# EAGLE board stm32 v0.7 eagle_v7 (EAGLE 7.7.0), part 1 of 2
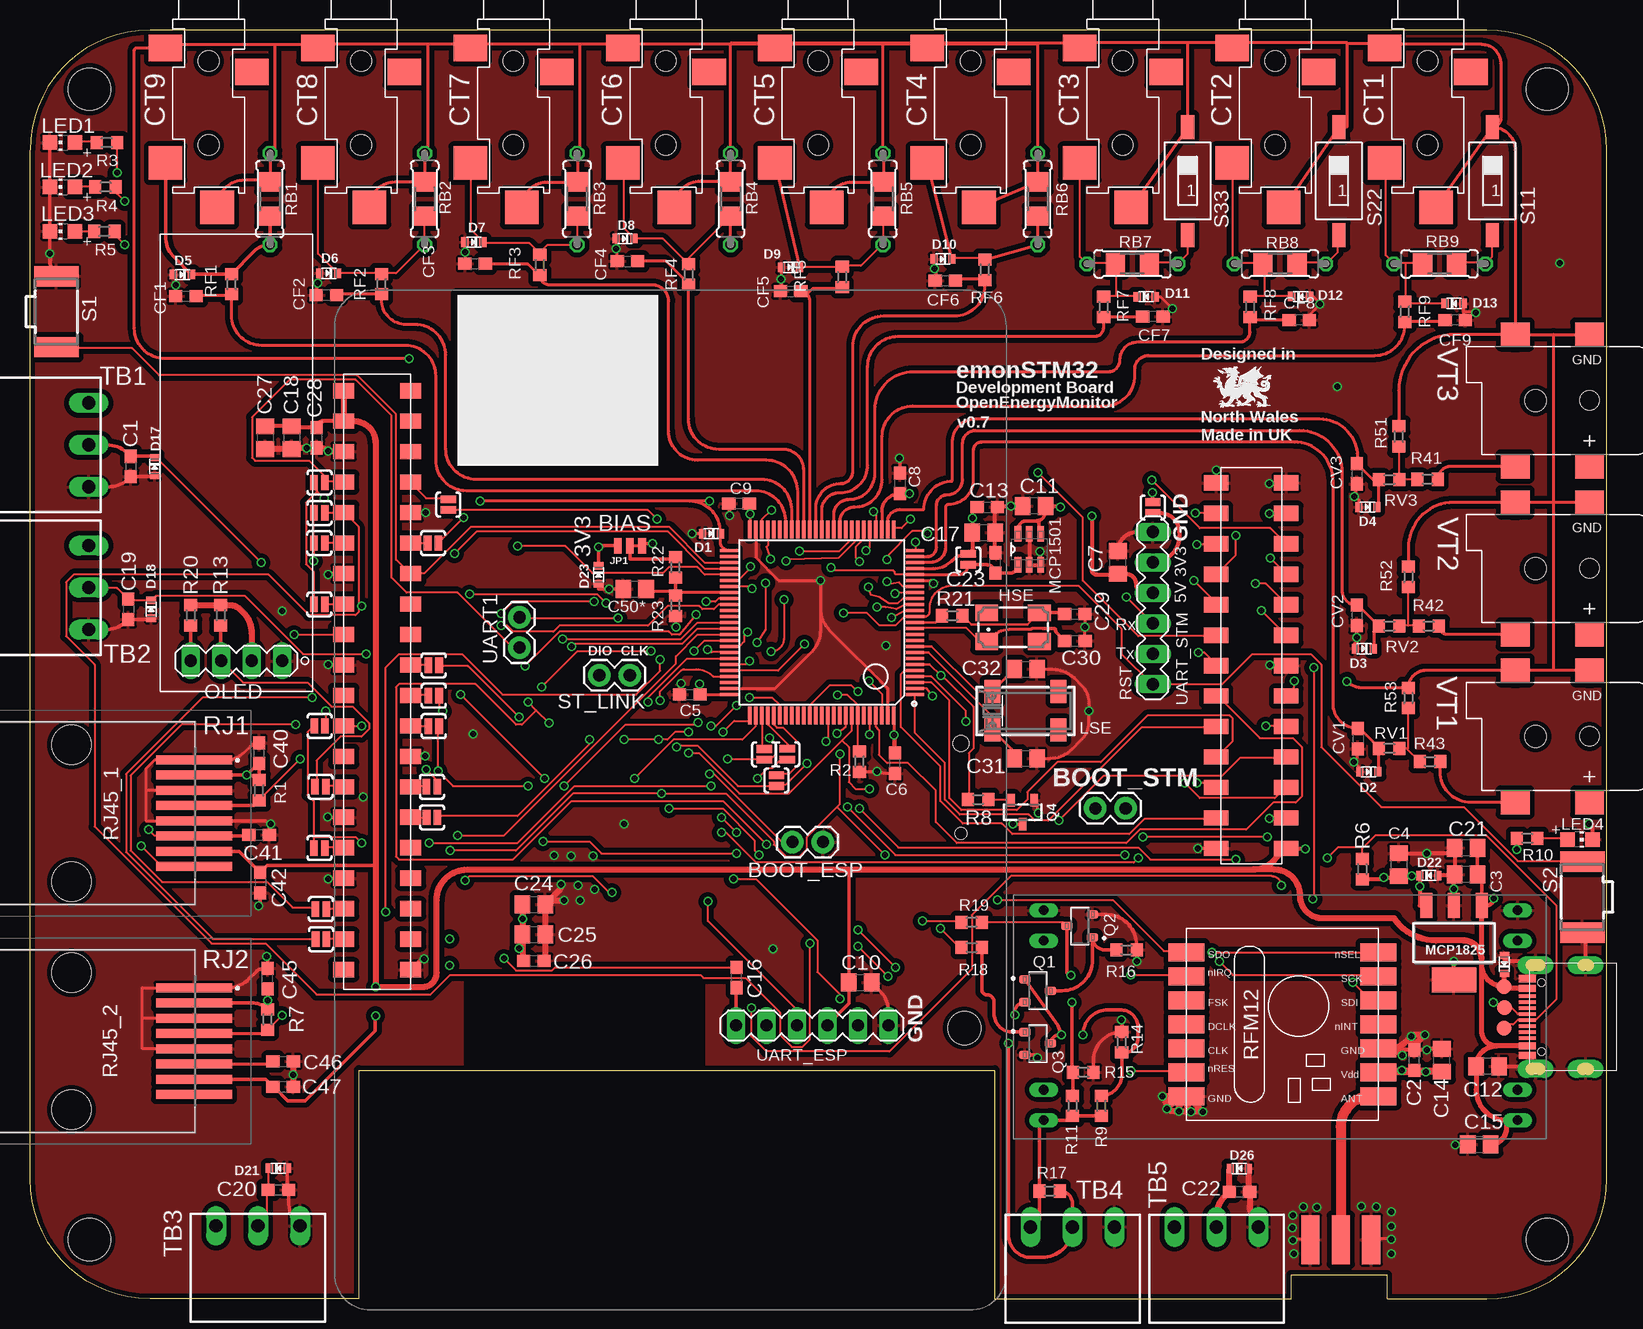
[diagram p2: board, top side]
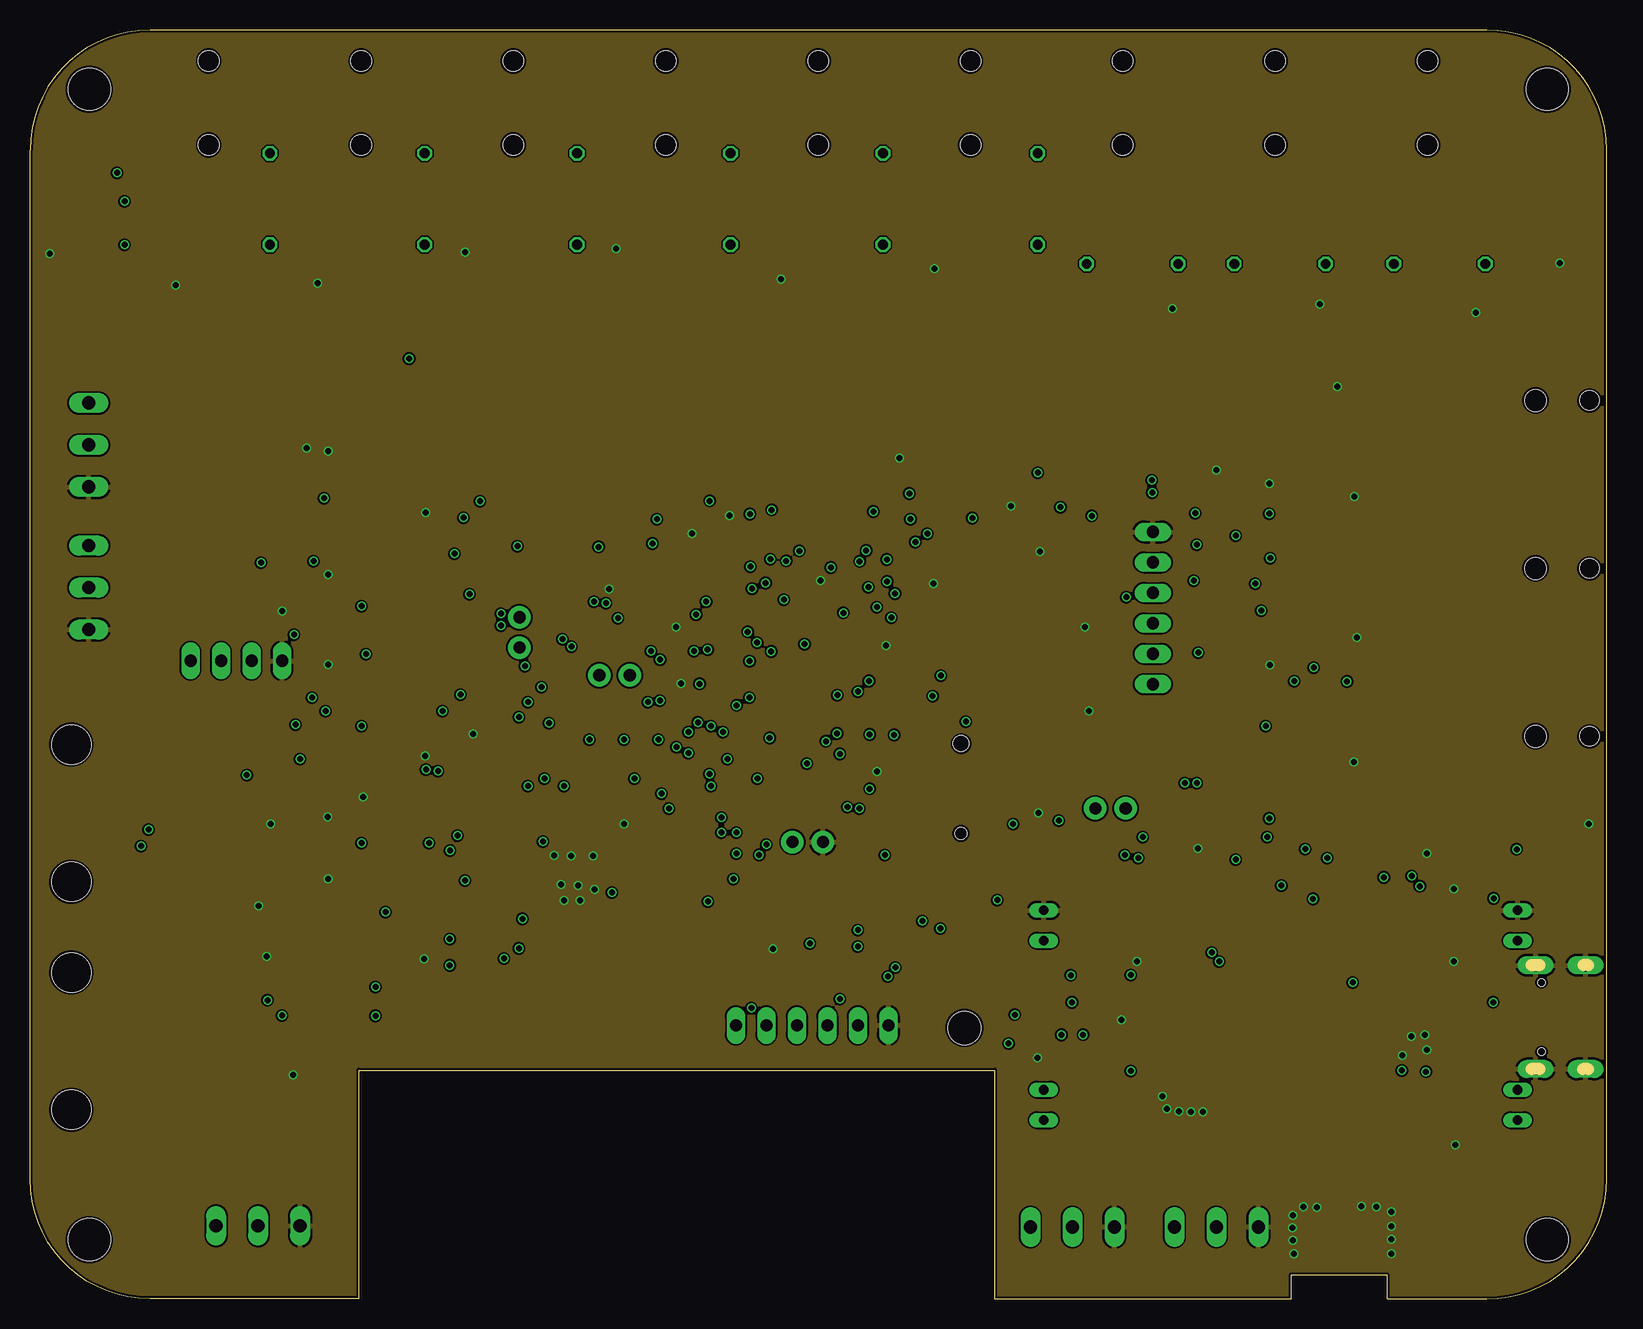
[diagram p3: board, inner layer GND]
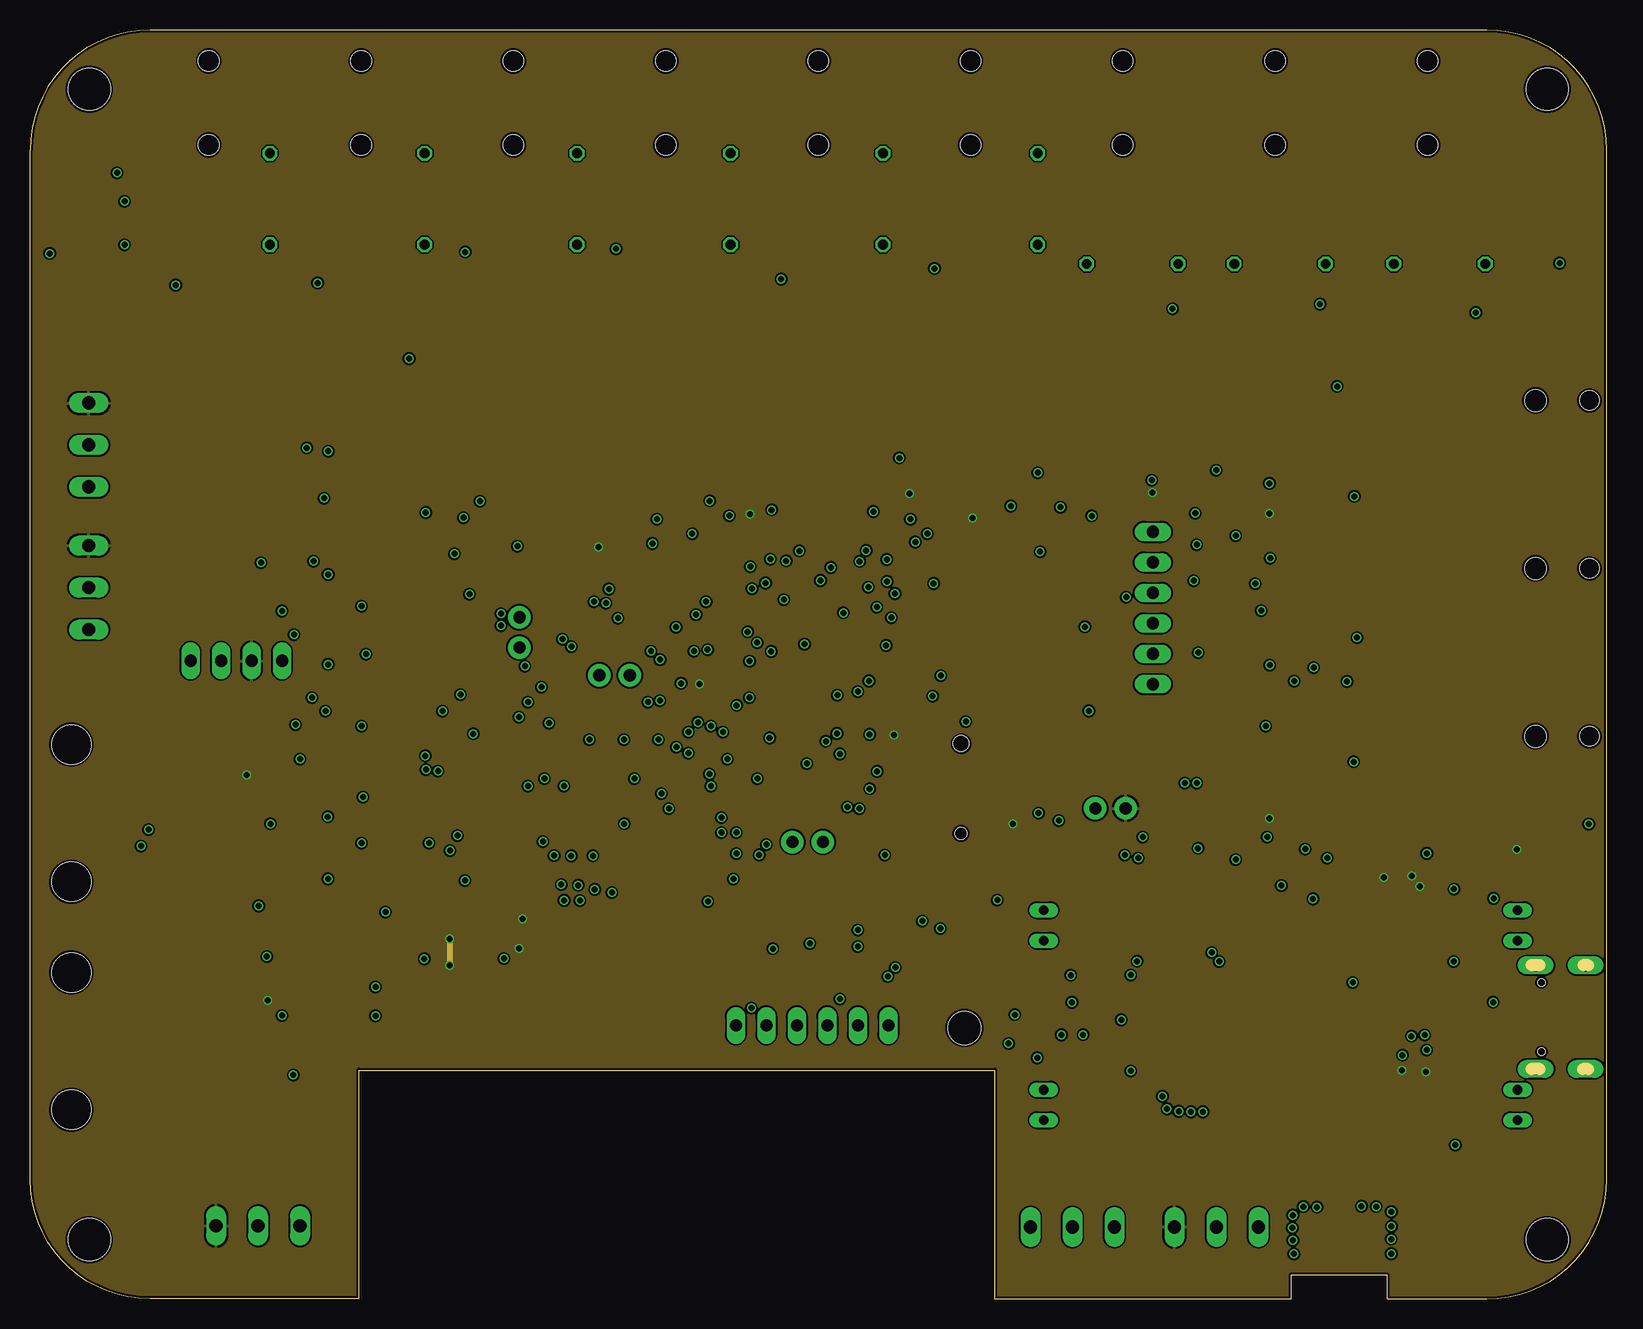
[diagram p4: board, inner layer +3V3]
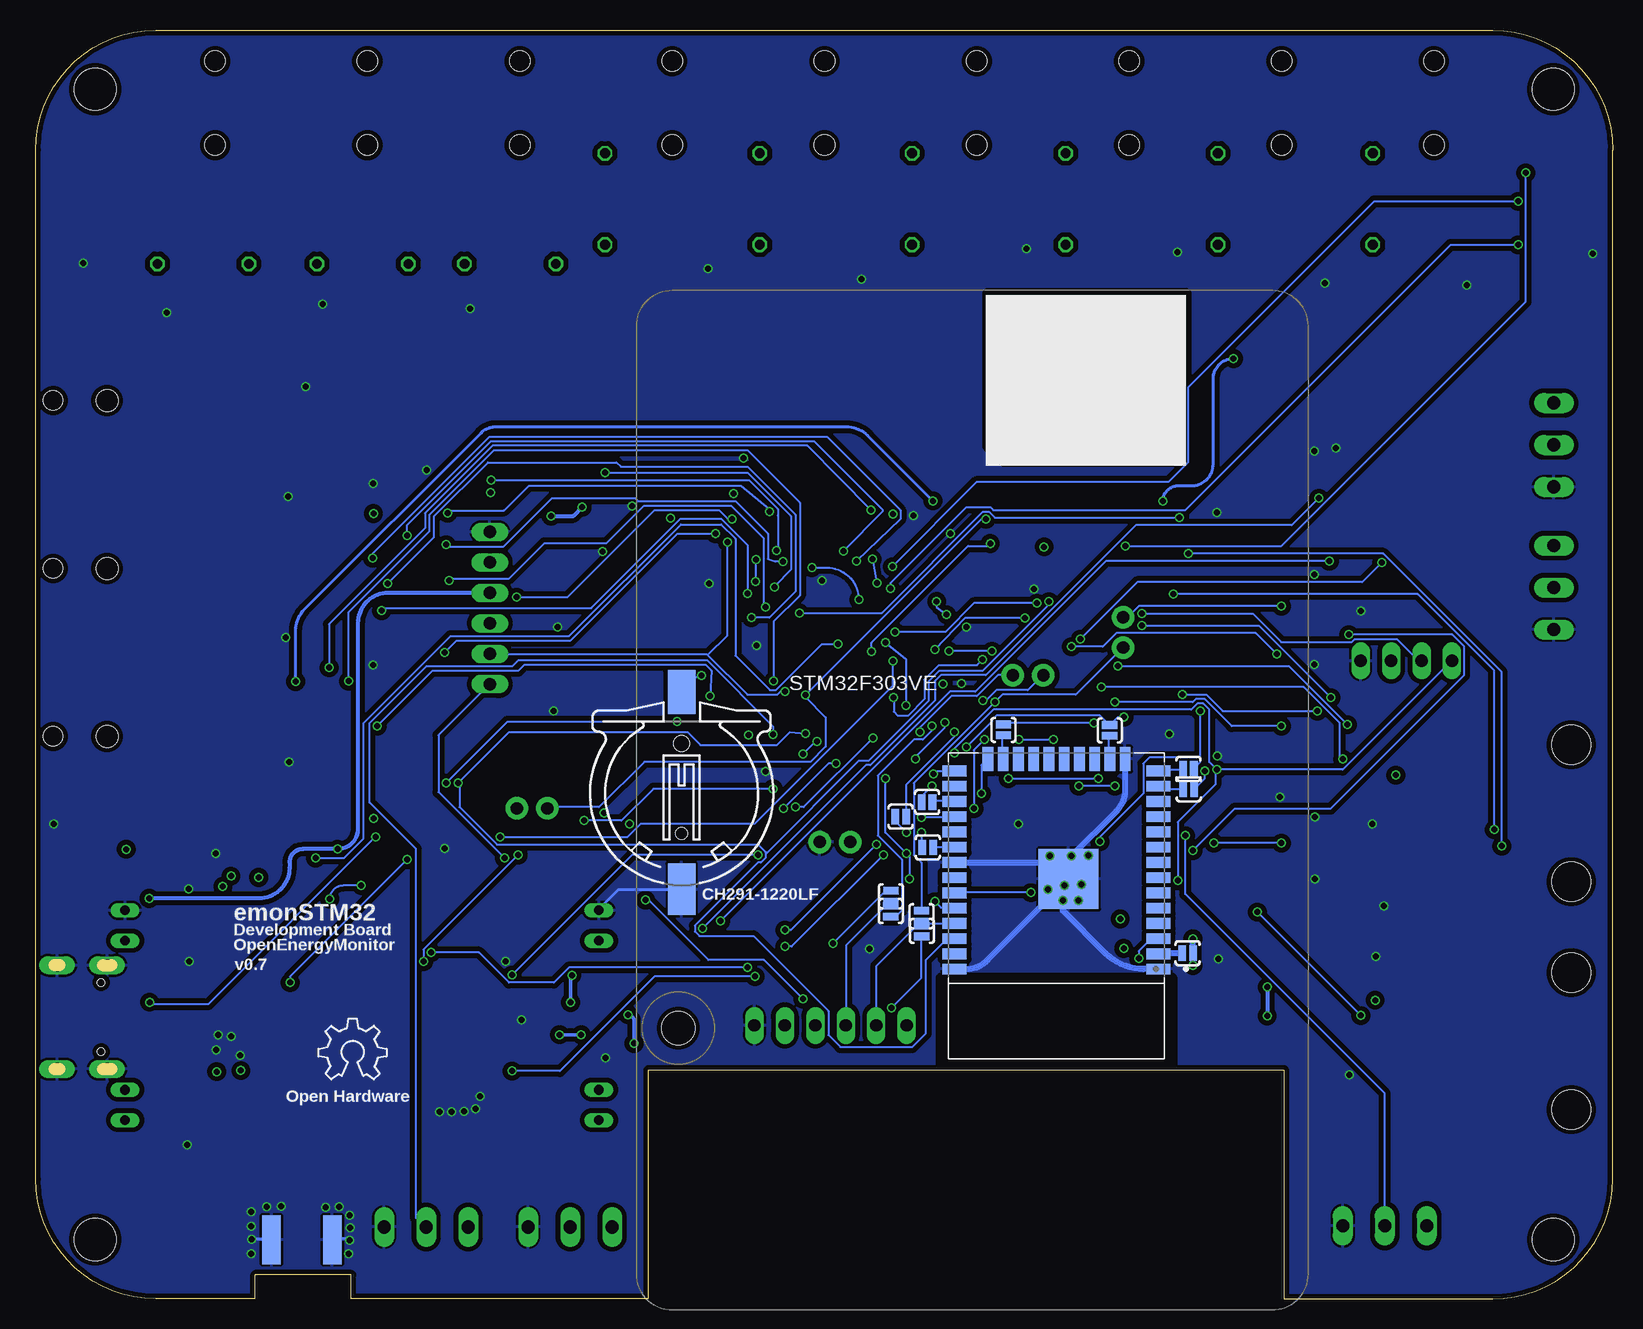
[diagram p5: board, bottom side, seen from below]

Size 131.44 x 105.79 mm. Coordinates in mm from the lower left corner, seen from the top.
Outline: 131.44,10 131.44,95.79 arc90 121.44,105.79 10,105.79 arc90 0,95.79 0,10 arc90 10,0 27.4,0 27.4,19.07 80.41,19.07 80.41,0 105.14,0 105.14,2 113.14,2 113.14,0 121.44,0 arc90 131.44,10
Copper layers (1+2*15+16): Top 0.035mm / dielectric 0.2mm / GND 0.035mm / dielectric 1.1mm / +3V3 0.035mm / dielectric 0.2mm / Bottom 0.035mm
Design rules "ragworm *": minimum track width 7mil, minimum drill 0.5mm, track to track 6mil, track to pad 6mil, pad to pad 7mil, via to via 8mil, smd to smd 0mil, copper to edge 8mil, drill to drill 10mil, minimum pad ring 3mil, minimum via ring 3mil, stop-mask expansion 2mil, vias tented up to drill 25mil, thermal gap 8mil
Net classes: 0 default: width 0.178 mm, drill 0.5 mm, clearance 0.152 mm; 1 power: width 0.305 mm, drill 0.5 mm, clearance 0.152 mm; 2 gnd: width 0.254 mm, drill 0.5 mm, clearance 0.152 mm; 3 ant: width 0.406 mm, drill 0.5 mm, clearance 0.254 mm; 4 cts_vts: width 0.254 mm, drill 0.5 mm, clearance 0.254 mm
Holes 3.5 mm at 126.49,100.85 4.95,100.85 4.95,4.95 126.49,4.95
tRestrict: area 36.6,18.4 to 55.9,26.8; area 35.6,69.8 to 52.1,83.8
bRestrict: area 36.7,18.4 to 56,26.8; area 35.6,69.8 to 52.1,83.8

## Footprints (pad centres in the part's own frame; a part is rotated, then mirrored left to right if it is on the bottom)
1X02 = drill 1.016 pad 1.88: 1 0,0; 2 2.54,0
C0603 = smd 1.1 x 1: 1 -0.85,0; 2 0.85,0
C0805 = smd 1.3 x 1.5: 1 -0.95,0; 2 0.95,0
STEREO_SMT = smd 2.8 x 2.2: P$1 -3.6,-2.4; P$3 3.6,-4.4 | smd 2.8 x 2.8: P$2 -3.6,-12; P$4 0.7,-15.7 | hole 1.7: 0,-3.5; 0,-10.5
SOD-523 = smd 0.8 x 0.6: A 0,-0.75; K 0,0.75
2X13_SMT = smd 1.27 x 2.032: 1 -15.24,-2.921; 2 -15.24,2.921; 3 -12.7,-2.921; 4 -12.7,2.921; 5 -10.16,-2.921; 6 -10.16,2.921; 7 -7.62,-2.921; 8 -7.62,2.921; 9 -5.08,-2.921; 10 -5.08,2.921; 11 -2.54,-2.921; 12 -2.54,2.921; 13 0,-2.921; 14 0,2.921; 15 2.54,-2.921; 16 2.54,2.921; 17 5.08,-2.921; 18 5.08,2.921; 19 7.62,-2.921; 20 7.62,2.921; 21 10.16,-2.921; 22 10.16,2.921; 23 12.7,-2.921; 24 12.7,2.921; 25 15.24,-2.921; 26 15.24,2.921
CH291-1220LF = smd 2.3 x 3.66: + 0,-2.296 | smd 2.3 x 4.3: - 0,14.146 | hole 1.3: 0,2 | hole 1: 0,9.5
CTS406 = smd 1.9 x 1.4: 1 -2.2,-1.2; 2 2.2,-1.2; 3 2.2,1.2; 4 -2.2,1.2
SJ_2S-NO = smd 0.635 x 1.27: 1 -0.45,0; 2 0.45,0
SMA-EDGE = smd 1.524 x 4.064: GND@0 0,0; GND@1 5.08,0; SIG 2.54,0 | smd 1.524 x 4.064 bottom: GND@2 0,0; GND@3 5.08,0
SMT-JUMPER_3_1-NC_TRACE_NO-SILK = smd 0.635 x 1.27: 1 -1.016,0; 2 0,0; 3 1.016,0
CHIP-LED0805 = smd 1.2 x 1.2: A 0,-1.05; C 0,1.05
CRYSTAL_8X3.8 = smd 1.3 x 1.9: P$1 -2.75,-1.6; P$2 2.75,-1.6; P$3 2.75,1.6; P$4 -2.75,1.6
SOT-223 = smd 1 x 2.1: 1 -2.3,-3.1; 2 0,-3.1; 3 2.3,-3.1 | smd 3.7 x 2.1: 4 0,3.1
MA04-1-OLED = drill 1.016 long: 1 -3.81,0; 2 -1.27,0; 3 1.27,0; 4 3.81,0
RPI3MIRROR2 = smd 1.27 x 1.778: P$41 8.371,6.351; P$42 8.371,0.763; P$43 10.911,6.351; P$44 10.911,0.763; P$45 13.451,6.351; P$46 13.451,0.763; P$47 15.991,6.351; P$48 15.991,0.763; P$49 18.531,6.351; P$50 18.531,0.763; P$51 21.071,6.351; P$52 21.071,0.763; P$53 23.611,6.351; P$54 23.611,0.763; P$55 26.151,6.351; P$56 26.151,0.763; P$57 28.691,6.351; P$58 28.691,0.763; P$59 31.231,6.351; P$60 31.231,0.763; P$61 33.771,6.351; P$62 33.771,0.763; P$63 36.311,6.351; P$64 36.311,0.763; P$65 38.851,6.351; P$66 38.851,0.763; P$67 41.391,6.351; P$68 41.391,0.763; P$69 43.931,6.351; P$70 43.931,0.763; P$71 46.471,6.351; P$72 46.471,0.763; P$73 49.011,6.351; P$74 49.011,0.763; P$75 51.551,6.351; P$76 51.551,0.763; P$77 54.091,6.351; P$78 54.091,0.763; P$79 56.631,6.351; P$80 56.631,0.763 | hole 2.75: 61.5,52.505
SOT23 = smd 0.71 x 0.96: 1 -0.95,-1.075; 2 0.95,-1.075; 3 0,1.075
SOT23-R = smd 0.635 x 1.016: 1 -0.95,-1; 2 0.95,-1; 3 0,1
R0603 = smd 1 x 1.1: 1 -0.85,0; 2 0.85,0
R1206 = smd 1.6 x 1.803: 1 -1.422,0; 2 1.422,0
0207/7 = drill 0.813 octagon: 1 -3.81,0; 2 3.81,0
RFM12 = smd 1.5 x 3: 1 -5,-10; 2 -3,-10; 3 -1,-10; 4 1,-10; 5 3,-10; 6 5,-10; 7 7,-10; 8 7,6; 9 5,6; 10 3,6; 11 1,6; 12 -1,6; 13 -3,6; 14 -5,6
955016889 = smd 0.76 x 6.35: 1 -4.445,8.975; 2 -3.175,8.975; 3 -1.905,8.975; 4 -0.635,8.975; 5 0.635,8.975; 6 1.905,8.975; 7 3.175,8.975; 8 4.445,8.975 | hole 3.25: -5.715,-1.25; 5.715,-1.25
KSS = smd 1.7 x 3.7: 1 -2.95,0; 2 2.95,0
SMS-001 = smd 1.092 x 2.007: 1 0,-4.496; 2 0,4.496
TQFP100 = smd 0.27 x 1.5: 1 -6,-7.75; 2 -5.5,-7.75; 3 -5,-7.75; 4 -4.5,-7.75; 5 -4,-7.75; 6 -3.5,-7.75; 7 -3,-7.75; 8 -2.5,-7.75; 9 -2,-7.75; 10 -1.5,-7.75; 11 -1,-7.75; 12 -0.5,-7.75; 13 0,-7.75; 14 0.5,-7.75; 15 1,-7.75; 16 1.5,-7.75; 17 2,-7.75; 18 2.5,-7.75; 19 3,-7.75; 20 3.5,-7.75; 21 4,-7.75; 22 4.5,-7.75; 23 5,-7.75; 24 5.5,-7.75; 25 6,-7.75; 51 6,7.75; 52 5.5,7.75; 53 5,7.75; 54 4.5,7.75; 55 4,7.75; 56 3.5,7.75; 57 3,7.75; 58 2.5,7.75; 59 2,7.75; 60 1.5,7.75; 61 1,7.75; 62 0.5,7.75; 63 0,7.75; 64 -0.5,7.75; 65 -1,7.75; 66 -1.5,7.75; 67 -2,7.75; 68 -2.5,7.75; 69 -3,7.75; 70 -3.5,7.75; 71 -4,7.75; 72 -4.5,7.75; 73 -5,7.75; 74 -5.5,7.75; 75 -6,7.75 | smd 1.5 x 0.27: 26 7.75,-6; 27 7.75,-5.5; 28 7.75,-5; 29 7.75,-4.5; 30 7.75,-4; 31 7.75,-3.5; 32 7.75,-3; 33 7.75,-2.5; 34 7.75,-2; 35 7.75,-1.5; 36 7.75,-1; 37 7.75,-0.5; 38 7.75,0; 39 7.75,0.5; 40 7.75,1; 41 7.75,1.5; 42 7.75,2; 43 7.75,2.5; 44 7.75,3; 45 7.75,3.5; 46 7.75,4; 47 7.75,4.5; 48 7.75,5; 49 7.75,5.5; 50 7.75,6; 76 -7.75,6; 77 -7.75,5.5; 78 -7.75,5; 79 -7.75,4.5; 80 -7.75,4; 81 -7.75,3.5; 82 -7.75,3; 83 -7.75,2.5; 84 -7.75,2; 85 -7.75,1.5; 86 -7.75,1; 87 -7.75,0.5; 88 -7.75,0; 89 -7.75,-0.5; 90 -7.75,-1; 91 -7.75,-1.5; 92 -7.75,-2; 93 -7.75,-2.5; 94 -7.75,-3; 95 -7.75,-3.5; 96 -7.75,-4; 97 -7.75,-4.5; 98 -7.75,-5; 99 -7.75,-5.5; 100 -7.75,-6
MA06-1 = drill 1.016 long: 1 -6.35,0; 2 -3.81,0; 3 -1.27,0; 4 1.27,0; 5 3.81,0; 6 6.35,0
B1,27 = smd 1.27 x 1.27: TP 0,0
MODULE_ESP32-WROOM-32D = smd 2 x 0.9: 1 -8.5,5.26; 2 -8.5,3.99; 3 -8.5,2.72; 4 -8.5,1.45; 5 -8.5,0.18; 6 -8.5,-1.09; 7 -8.5,-2.36; 8 -8.5,-3.63; 9 -8.5,-4.9; 10 -8.5,-6.17; 11 -8.5,-7.44; 12 -8.5,-8.71; 13 -8.5,-9.98; 14 -8.5,-11.25; 25 8.5,-11.25; 26 8.5,-9.98; 27 8.5,-8.71; 28 8.5,-7.44; 29 8.5,-6.17; 30 8.5,-4.9; 31 8.5,-3.63; 32 8.5,-2.36; 33 8.5,-1.09; 34 8.5,0.18; 35 8.5,1.45; 36 8.5,2.72; 37 8.5,3.99; 38 8.5,5.26 | smd 0.9 x 2: 15 -5.715,-12.25; 16 -4.445,-12.25; 17 -3.175,-12.25; 18 -1.905,-12.25; 19 -0.635,-12.25; 20 0.635,-12.25; 21 1.905,-12.25; 22 3.175,-12.25; 23 4.445,-12.25; 24 5.715,-12.25 | smd 5 x 5: 39 -1,-2.24
3.5MM_X3 = drill 1.1 long: P$1 0,3.5; P$2 0,0; P$3 0,-3.5
BOOST = drill 0.8 long: IN+ 17.5,39.5; IN+1 14.96,39.5; OUT+ 17.5,0; OUT+1 14.96,0; P$1 0,0; P$2 0,39.5; P$3 2.54,39.5; P$4 2.54,0
USB-C = smd 0.6 x 1.4: A1/B12 -3.2,0.7; A4/B9 -2.4,0.7; B1/A12 3.2,0.7; B4/A9 2.4,0.7 | smd 0.3 x 1.4: A5 -1.25,0.7; A6 -0.25,0.7; A7 0.25,0.7; A8 1.25,0.7; B5 1.75,0.7; B6 0.75,0.7; B7 -0.75,0.7; B8 -1.75,0.7 | drill 1 pad 1.2 long: GND1 -4.32,0; GND2 4.33,0; GND3 4.33,-4.18; GND4 -4.32,-4.18 | hole 0.6: -2.89,-0.5; 2.89,-0.5
SOT95P280X145-6N = smd 1.27 x 0.559: 1 -1.295,0.94; 2 -1.295,0; 3 -1.295,-0.94; 4 1.295,-0.94; 5 1.295,0; 6 1.295,0.94
DCJACK_2MM_SMT = smd 2.4 x 2: GND 0,-5.5; GNDBREAK 6.2,-5.5; PWR1 0,5.5; PWR2 6.2,5.5 | hole 1.6: 0,0 | hole 1.8: 4.5,0

## Placement (x,y rotation side)
BOOT_ESP  [1X02]  66.1,38.1 180 top
BOOT_STM  [1X02]  88.8,40.9 0 top
C1  100nF  [C0603]  8.4,69.4 270 top
C2  100nF  [C0603]  115.4,19.9 90 top
C3  2.2uF  [C0805]  119.7,35.4 180 top
C4  2.2uF  [C0805]  114.1,36.2 270 top
C5  100nF  [C0603]  55,50.4 0 top
C6  100nF  [C0603]  72.1,44.67 90 top
C7  2.2uF  [C0805]  90.7,61.4 90 top
C8  100nF  [C0603]  72.5,68 270 top
C9  100nF  [C0603]  59.1,66.33 0 top
C10  2.2uF  [C0805]  69.2,26.4 0 top
C11  2.2uF  [C0805]  83.7,66.1 180 top
C12  2.2uF  [C0805]  121.5,19.4 180 top
C13  100nF  [C0603]  79.8,66 0 top
C14  2.2uF  [C0805]  117.7,19.9 90 top
C15  2.2uF  [C0805]  120.8,12.9 0 top
C16  100nF  [C0603]  58.9,26.8 90 top
C17  2.2uF  [C0805]  79.5,63.9 0 top
C18  2.2uF  [C0805]  21.8,71.8 270 top
C19  100nF  [C0603]  8.2,57.5 270 top
C20  100nF  [C0603]  20.7,9.1 0 top
C21  2.2uF  [C0805]  119.7,37.6 180 top
C22  100nF  [C0603]  100.82,8.95 0 top
C23  200pF*  [C0603]  80.46,61.36 90 top
C24  2.2uF  [C0805]  42,32.9 0 top
C25  2.2uF  [C0805]  42,30.4 0 top
C26  100nF  [C0603]  42,28.2 0 top
C27  2.2uF  [C0805]  19.6,71.8 270 top
C28  100nF  [C0603]  23.9,71.8 270 top
C29  5nF  [C0603]  87.09,57.09 0 top
C30  5nF  [C0603]  87.1,54.86 0 top
C31  2.2uF  [C0805]  83,45.08 0 top
C32  2.2uF  [C0805]  83,52.5 0 top
C40  100nF  [C0603]  19.1,45.5 90 top
C41  100nF  [C0603]  19.1,38.7 0 top
C42  100nF  [C0603]  19.2,34.7 270 top
C45  100nF  [C0603]  19.8,26.7 90 top
C46  100nF  [C0603]  21.1,19.8 0 top
C47  100nF  [C0603]  21.1,17.7 0 top
C50*  2.2uF  [C0805]  50.4,59.2 0 top
CF1  100nF  [C0603]  13,83.6 0 top
CF2  100nF  [C0603]  24.7,83.7 0 top
CF3  100nF  [C0603]  37.1,86.3 0 top
CF4  100nF  [C0603]  49.8,86.5 0 top
CF5  100nF  [C0603]  63.4,84 0 top
CF6  100nF  [C0603]  76.3,84.9 0 top
CF7  100nF  [C0603]  93.6,81.9 180 top
CF8  100nF  [C0603]  105.81,81.61 180 top
CF9  100nF  [C0603]  118.8,81.6 180 top
CT1  SJ-3523-SMT  [STEREO_SMT]  116.5,106.7 0 top
CT2  SJ-3523-SMT  [STEREO_SMT]  103.8,106.7 0 top
CT3  SJ-3523-SMT  [STEREO_SMT]  91.1,106.7 0 top
CT4  SJ-3523-SMT  [STEREO_SMT]  78.4,106.7 0 top
CT5  SJ-3523-SMT  [STEREO_SMT]  65.7,106.7 0 top
CT6  SJ-3523-SMT  [STEREO_SMT]  53,106.7 0 top
CT7  SJ-3523-SMT  [STEREO_SMT]  40.3,106.7 0 top
CT8  SJ-3523-SMT  [STEREO_SMT]  27.6,106.7 0 top
CT9  SJ-3523-SMT  [STEREO_SMT]  14.9,106.7 0 top
CV1  100nF  [C0603]  110.7,46.7 270 top
CV2  100nF  [C0603]  110.6,57 270 top
CV3  100nF  [C0603]  110.6,68.8 270 top
D1  ESD5Z3.3T1G  [SOD-523]  56.8,63.8 270 top
D2  ESD5Z3.3T1G  [SOD-523]  111.6,43.94 270 top
D3  ESD5Z3.3T1G  [SOD-523]  111.22,54.22 270 top
D4  ESD5Z3.3T1G  [SOD-523]  111.51,66.02 270 top
D5  ESD5Z3.3T1G  [SOD-523]  12.7,85.4 270 top
D6  ESD5Z3.3T1G  [SOD-523]  24.9,85.5 270 top
D7  ESD5Z3.3T1G  [SOD-523]  37,88.1 270 top
D8  ESD5Z3.3T1G  [SOD-523]  49.6,88.4 270 top
D9  ESD5Z3.3T1G  [SOD-523]  63.4,86 270 top
D10  ESD5Z3.3T1G  [SOD-523]  76.1,86.7 270 top
D11  ESD5Z3.3T1G  [SOD-523]  93.03,83.56 90 top
D12  ESD5Z3.3T1G  [SOD-523]  105.92,83.57 90 top
D13  ESD5Z3.3T1G  [SOD-523]  118.71,82.99 90 top
D17  ESD5Z3.3T1G  [SOD-523]  10.4,69.4 0 top
D18  ESD5Z3.3T1G  [SOD-523]  10.1,57.5 0 top
D21  ESD5Z3.3T1G  [SOD-523]  20.7,10.9 90 top
D22  ESD5Z3.3T1G  [SOD-523]  116.6,35.3 90 top
D23  ESD5Z3.3T1G  [SOD-523]  47.39,60.38 0 top
D26  ESD5Z3.3T1G  [SOD-523]  100.8,10.88 90 top
D40*1  ESD5Z5.0T1G  [SOD-523]  122.9,27.9 180 top
EXPANSION  TSM-113-01-T-DV  [2X13_SMT]  101.8,52.8 270 top
G1  CH291-1220LF  [CH291-1220LF]  77.61,48.3 180 bottom
HSE  406C35E08M00000  [CTS406]  81.95,56.01 0 top
J1  SOLDERJUMPERNO  [SJ_2S-NO]  34.87,66.23 90 top
J$1  SMA_EDGE  [SMA-EDGE]  106.72,4.93 0 top
JP1  JUMPER-SMT_3_1-NC_TRACE_NO-SILK  [SMT-JUMPER_3_1-NC_TRACE_NO-SILK]  50,62.8 0 top
LED1  Green 1.85V  [CHIP-LED0805]  2.7,96.4 90 top
LED2  Orange 1.85V  [CHIP-LED0805]  2.7,92.7 90 top
LED3  Red 1.85V  [CHIP-LED0805]  2.7,89 90 top
LED4  Green 1.85V  [CHIP-LED0805]  129.2,38.3 270 top
LOGO1  OSHW_LOGO_6MILX0200-NT  [OSHW_6X200_NOTEXT]  107.87,18.31 0 bottom
LSE  32.768kHz  [CRYSTAL_8X3.8]  82.98,49.04 0 top
MCP1825  MCP1825SOT-223-3  [SOT-223]  118.7,29.7 180 top
OLED  [MA04-1-OLED]  17.2,53.2 0 top
PCB2  TSM-120-01-T-DV  [RPI3MIRROR2]  25.38,84.09 270 top
Q1  MMBT3906  [SOT23]  84,25.7 270 top
Q2  MMBT3904  [SOT23]  87.5,31.1 90 top
Q3  MMBT3904  [SOT23]  84,21.3 270 top
Q4  [SOT23-R]  82.75,40.58 180 top
R1  4.7k  [R0603]  19.1,42.4 90 top
R2  10k  [R0603]  69.14,44.8 270 top
R3  330R  [R0603]  6.4,96.4 0 top
R4  330R  [R0603]  6.3,92.7 0 top
R5  330R  [R0603]  6.2,89 0 top
R6  1.5k  [R0603]  111.06,35.83 90 top
R7  4.7k  [R0603]  19.8,23.3 90 top
R8  1.5k  [R0603]  79.04,41.64 180 top
R9  39K  [R0603]  89.3,16.1 270 top
R10  330R  [R0603]  124.8,38.4 180 top
R11  33K  [R0603]  86.9,16.1 270 top
R13  10k  [R0603]  15.9,57 270 top
R14  22K  [R0603]  91,21.4 270 top
R15  3k3  [R0603]  87.8,18.9 180 top
R16  82R  [R0603]  91.4,29.1 180 top
R17  220K  [R0603]  85,9 180 top
R18  1k  [R0603]  78.5,29.3 180 top
R19  1k  [R0603]  78.5,31.4 180 top
R20  10k  [R0603]  13.4,57 270 top
R21  200k  [R0603]  76.88,56.96 0 top
R22  10k  [R0603]  53.8,61 90 top
R23  10k  [R0603]  53.8,57.8 90 top
R41  120k  [R0603]  116.5,68.33 180 top
R42  120k  [R0603]  116.6,56.1 0 top
R43  120k  [R0603]  116.7,44.8 0 top
R51  10k  [R0603]  114.1,71.9 90 top
R52  10k  [R0603]  114.9,60.2 90 top
R53  10k  [R0603]  114.9,50.1 90 top
RB1  22r  [R1206]  20,91.7 90 top
RB2  22r  [R1206]  32.9,91.7 90 top
RB3  22r  [R1206]  45.6,91.7 90 top
RB4  22r  [R1206]  58.4,91.7 90 top
RB5  22r  [R1206]  71.1,91.7 90 top
RB6  22r  [R1206]  84,91.7 90 top
RB7  22r  [R1206]  91.9,86.3 0 top
RB8  22r  [R1206]  104.2,86.3 0 top
RB9  22r  [R1206]  117.5,86.3 0 top
RB10  22r  [0207/7]  20,91.7 90 top
RB11  22r  [0207/7]  32.9,91.7 90 top
RB12  22r  [0207/7]  45.6,91.7 90 top
RB13  22r  [0207/7]  84,91.7 90 top
RB14  22r  [0207/7]  71.1,91.7 90 top
RB15  22r  [0207/7]  58.4,91.7 90 top
RB16  22r  [0207/7]  91.9,86.3 0 top
RB17  22r  [0207/7]  104.2,86.3 0 top
RB18  22r  [0207/7]  117.5,86.3 0 top
RF1  330R  [R0603]  16.8,84.6 270 top
RF2  330R  [R0603]  29.3,84.6 270 top
RF3  330R  [R0603]  42.5,86.2 270 top
RF4  330R  [R0603]  54.9,85.4 270 top
RF5  330R  [R0603]  67.7,85.2 270 top
RF6  330R  [R0603]  79.6,85.8 270 top
RF7  330R  [R0603]  89.5,82.7 270 top
RF8  330R  [R0603]  101.7,82.7 270 top
RF9  330R  [R0603]  114.6,82.3 270 top
RFM69HCW  RFM12_SMDSMD  [RFM12]  106.4,23.9 270 top
RJ45_1  95501-6889  [955016889]  4.7,40.5 270 top
RJ45_2  95501-6889  [955016889]  4.7,21.5 270 top
RV1  330R  [R0603]  113.3,45.9 180 top
RV2  330R  [R0603]  113.3,56.1 180 top
RV3  330R  [R0603]  113.3,68.3 180 top
S1  KSS221GLFS  [KSS]  2.2,82.3 270 top
S2  KSS221GLFS  [KSS]  129.4,33.5 90 top
S11  SWS001  [SMS-001]  121.9,93.2 0 top
S22  SWS001  [SMS-001]  109.11,93.2 0 top
S33  SWS001  [SMS-001]  96.5,93.2 0 top
SJ1  SOLDERJUMPERNO  [SJ_2S-NO]  93.6,65.99 90 top
SJ2  SOLDERJUMPERNO  [SJ_2S-NO]  78.21,61.66 270 top
SJ3  SOLDERJUMPERNO  [SJ_2S-NO]  57.59,30.68 270 bottom
SJ4  SOLDERJUMPERNO  [SJ_2S-NO]  35.35,44.2 0 bottom
SJ5  SOLDERJUMPERNO  [SJ_2S-NO]  33.66,52.83 180 top
SJ6  SOLDERJUMPERNO  [SJ_2S-NO]  33.66,50.29 180 top
SJ7  SOLDERJUMPERNO  [SJ_2S-NO]  33.66,47.75 180 top
SJ8  SOLDERJUMPERNO  [SJ_2S-NO]  24.13,37.59 180 top
SJ9  SOLDERJUMPERNO  [SJ_2S-NO]  41.93,47.4 90 bottom
SJ10  SOLDERJUMPERNO  [SJ_2S-NO]  35.35,42.5 0 bottom
SJ11  SOLDERJUMPERNO  [SJ_2S-NO]  24.13,68.07 180 top
SJ12  SOLDERJUMPERNO  [SJ_2S-NO]  24.13,65.53 180 top
SJ13  SOLDERJUMPERNO  [SJ_2S-NO]  50.78,47.45 90 bottom
SJ14  SOLDERJUMPERNO  [SJ_2S-NO]  24.15,47.78 0 top
SJ15  SOLDERJUMPERNO  [SJ_2S-NO]  61.2,45.4 270 top
SJ16  SOLDERJUMPERNO  [SJ_2S-NO]  63.13,45.41 270 top
SJ17  SOLDERJUMPERNO  [SJ_2S-NO]  62.22,43.22 270 top
SJ18  SOLDERJUMPERNO  [SJ_2S-NO]  60.18,32.34 270 bottom
SJ19  SOLDERJUMPERNO  [SJ_2S-NO]  57.15,41.42 180 bottom
SJ20  SOLDERJUMPERNO  [SJ_2S-NO]  57.61,31.91 270 bottom
SJ21  SOLDERJUMPERNO  [SJ_2S-NO]  60.17,33.58 270 bottom
SJ23  SOLDERJUMPERNO  [SJ_2S-NO]  35.43,28.83 0 bottom
SJ24  SOLDERJUMPERNO  [SJ_2S-NO]  59.35,40.21 0 bottom
SJ25  SOLDERJUMPERNO  [SJ_2S-NO]  57.09,37.65 180 bottom
SJ26  SOLDERJUMPERNO  [SJ_2S-NO]  33.51,42.7 180 top
SJ27  SOLDERJUMPERNO  [SJ_2S-NO]  24.21,42.7 180 top
SJ28  SOLDERJUMPERNO  [SJ_2S-NO]  33.51,40.15 180 top
SJ29  SOLDERJUMPERNO  [SJ_2S-NO]  24.25,32.5 180 top
SJ30  SOLDERJUMPERNO  [SJ_2S-NO]  24.26,29.99 180 top
SJ31  SOLDERJUMPERNO  [SJ_2S-NO]  24.12,63.02 180 top
SJ32  SOLDERJUMPERNO  [SJ_2S-NO]  33.6,63.01 180 top
SJ33  SOLDERJUMPERNO  [SJ_2S-NO]  24.12,57.91 180 top
ST_LINK  [1X02]  50,52 180 top
STM32F303VE  STM32F303VE  [TQFP100]  66,56.4 90 top
SV1  [MA06-1]  93.6,57.6 270 top
SV2  [MA06-1]  65.2,22.8 180 top
TP4  TPB1,27  [B1,27]  122.89,26.04 0 top
TP5  TPB1,27  [B1,27]  122.87,22.59 0 top
TP6  TPB1,27  [B1,27]  122.9,24.3 0 top
U1  ESP32-WROOM-32D  [MODULE_ESP32-WROOM-32D]  46.35,32.77 180 bottom
U$1  3.5MM_TERMINAL_BLOCK  [3.5MM_X3]  4.9,71.2 0 top
U$2  BOOST_MODULE  [BOOST]  84.5,32.4 270 top
U$3  3.5MM_TERMINAL_BLOCK  [3.5MM_X3]  4.9,59.3 0 top
U$4  3.5MM_TERMINAL_BLOCK  [3.5MM_X3]  19,6.1 90 top
U$5  3.5MM_TERMINAL_BLOCK  [3.5MM_X3]  98.9,6 90 top
U$6  3.5MM_TERMINAL_BLOCK  [3.5MM_X3]  86.9,6 90 top
UART1  [1X02]  40.8,54.3 90 top
USB-C  CSP-USC16-TR  [USB-C]  125.5,23.5 90 top
VREF_3V3  MCP1501T-33E  [SOT95P280X145-6N]  83.3,62.5 90 top
VT1  ADC-028-2-T  [DCJACK_2MM_SMT]  130,46.9 180 top
VT2  ADC-028-2-T  [DCJACK_2MM_SMT]  130,60.9 180 top
VT3  ADC-028-2-T  [DCJACK_2MM_SMT]  130,74.9 180 top